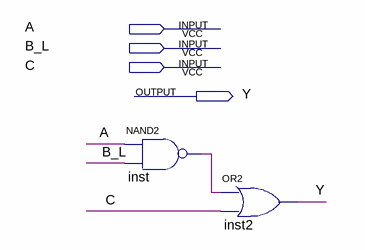
[diagram p0: schematic sheet]
// Quartus schematic Demo.bdf as structural Verilog: 2 symbols, 4 pins
module Demo (
  input  A,
  input  B_L,
  input  C,
  output Y
);

  wire inst_out;

  nand inst (inst_out, A, B_L);
  or inst2 (Y, inst_out, C);
endmodule
